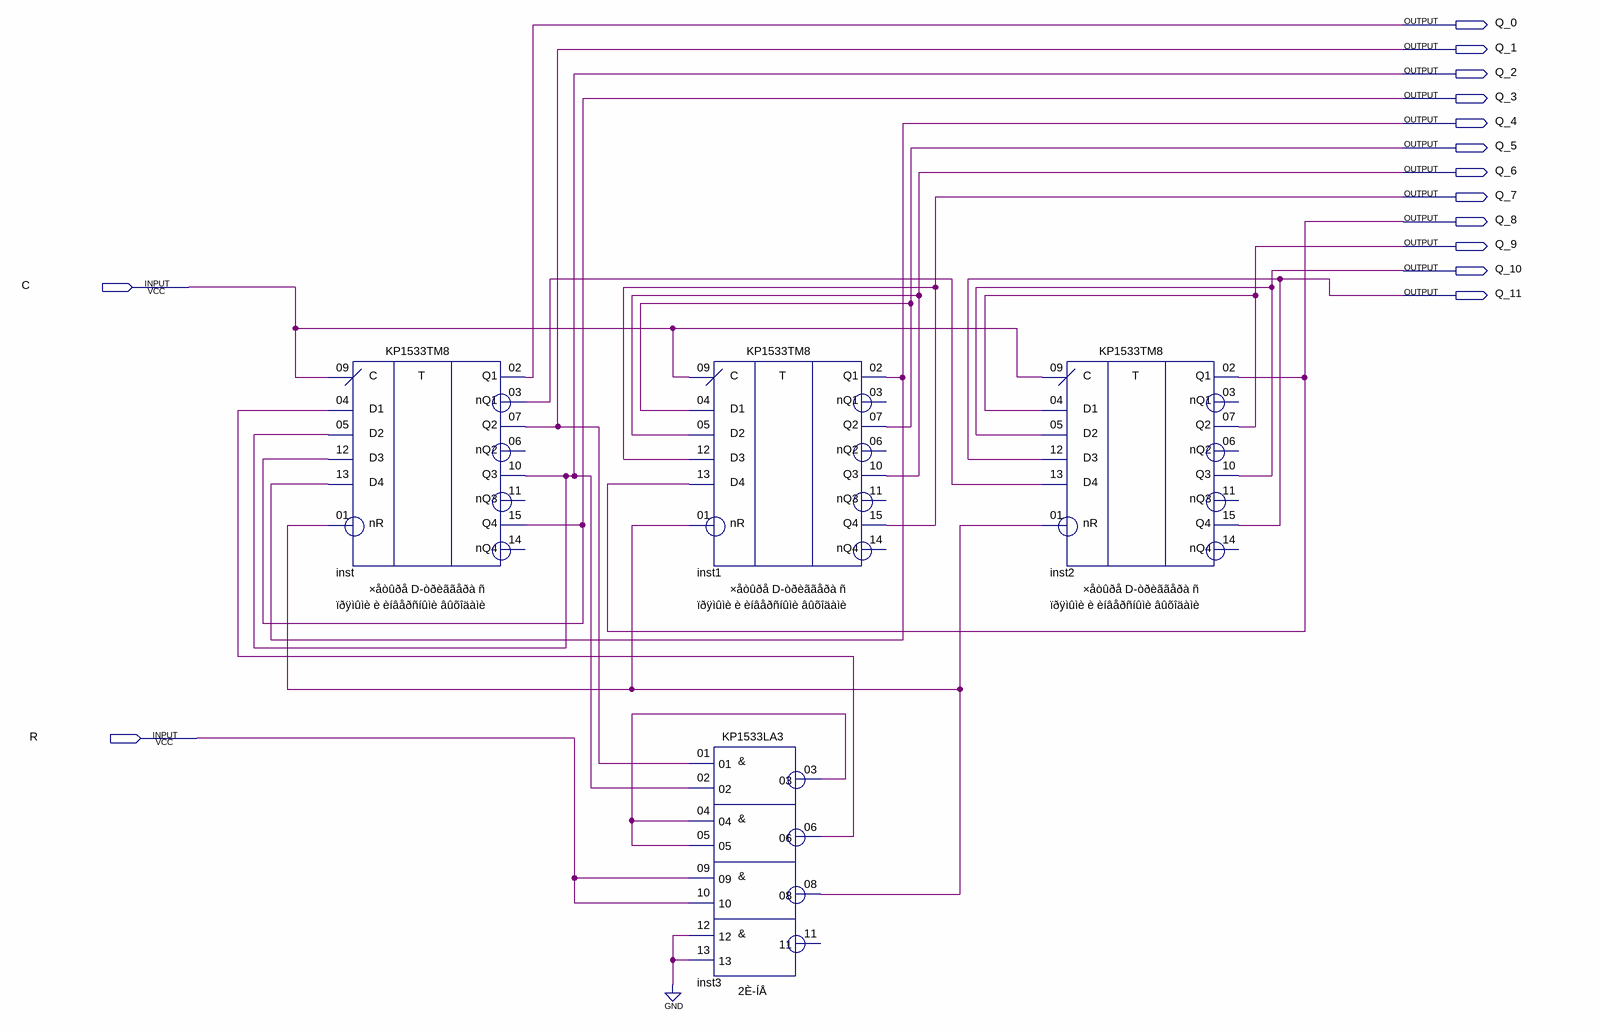
[diagram p0: schematic sheet]
// Quartus schematic Jonson.bdf as structural Verilog: 4 symbols, 14 pins
module Jonson (
  input  C,
  input  R,
  output Q_0,
  output Q_1,
  output Q_2,
  output Q_3,
  output Q_4,
  output Q_5,
  output Q_6,
  output Q_7,
  output Q_8,
  output Q_9,
  output Q_10,
  output Q_11
);

  wire inst3_03, inst3_06, inst3_08, inst_nq1;

  KP1533TM8 inst (
    .nR(inst3_08), .C(C), .D1(inst3_06), .D2(Q_2), .D3(Q_3), .D4(Q_4), .Q1(Q_0), .nQ1(inst_nq1), .Q2(Q_1),
    .Q3(Q_2), .Q4(Q_3));  // open: nQ2, nQ3, nQ4
  KP1533TM8 inst1 (
    .nR(inst3_08), .C(C), .D1(Q_5), .D2(Q_6), .D3(Q_7), .D4(Q_8), .Q1(Q_4), .Q2(Q_5), .Q3(Q_6), .Q4(Q_7));  // open: nQ1, nQ2, nQ3, nQ4
  KP1533LA3 inst3 (
    .\01 (Q_1), .\02 (Q_2), .\04 (inst3_03), .\05 (inst3_03), .\09 (R), .\10 (R), .\12 (1'b0), .\13 (1'b0),
    .\03 (inst3_03), .\06 (inst3_06), .\08 (inst3_08));  // open: 11
  KP1533TM8 inst2 (
    .nR(inst3_08), .C(C), .D1(Q_9), .D2(Q_10), .D3(Q_11), .D4(inst_nq1), .Q1(Q_8), .Q2(Q_9), .Q3(Q_10),
    .Q4(Q_11));  // open: nQ1, nQ2, nQ3, nQ4
endmodule
